# Altium schematic sheet Test Pins.SchDoc
size A; SheetNumber: 6; SheetTotal: 6
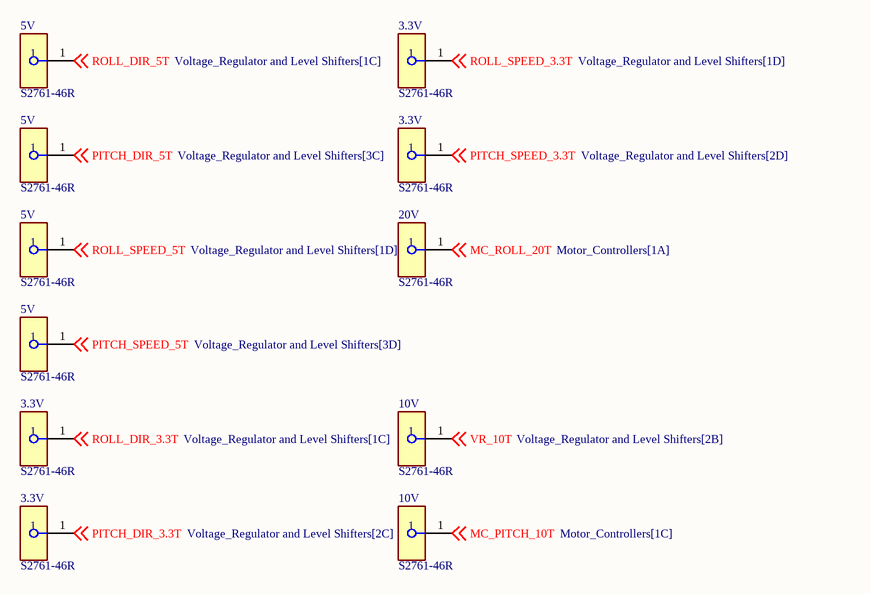
[diagram p0: Test Pins.SchDoc]

## Parts
(Parts that share a designator on the sheet are numbered #1, #2 ... from top to bottom, then left to right.)
3.3V#1  S2761-46R  [S2761-46R]
3.3V#2  S2761-46R  [S2761-46R]
3.3V#3  S2761-46R  [S2761-46R]
3.3V#4  S2761-46R  [S2761-46R]
5V#1  S2761-46R  [S2761-46R]
5V#2  S2761-46R  [S2761-46R]
5V#3  S2761-46R  [S2761-46R]
5V#4  S2761-46R  [S2761-46R]
10V#1  S2761-46R  [S2761-46R]
10V#2  S2761-46R  [S2761-46R]
20V  S2761-46R  [S2761-46R]

## Nets
MC_PITCH_10T: 10V#2.1 ; off-sheet MC_PITCH_10T
MC_ROLL_20T: 20V.1 ; off-sheet MC_ROLL_20T
PITCH_DIR_3.3T: 3.3V#4.1 ; off-sheet PITCH_DIR_3.3T
PITCH_DIR_5T: 5V#2.1 ; off-sheet PITCH_DIR_5T
PITCH_SPEED_3.3T: 3.3V#2.1 ; off-sheet PITCH_SPEED_3.3T
PITCH_SPEED_5T: 5V#4.1 ; off-sheet PITCH_SPEED_5T
ROLL_DIR_3.3T: 3.3V#3.1 ; off-sheet ROLL_DIR_3.3T
ROLL_DIR_5T: 5V#1.1 ; off-sheet ROLL_DIR_5T
ROLL_SPEED_3.3T: 3.3V#1.1 ; off-sheet ROLL_SPEED_3.3T
ROLL_SPEED_5T: 5V#3.1 ; off-sheet ROLL_SPEED_5T
VR_10T: 10V#1.1 ; off-sheet VR_10T

## Library data of the parts
3.3V#1-3.3V#4 5V#1-5V#4 10V#1 10V#2 20V = Test Point: PC TEST POINT NATURAL; Body Material: Brass; Plating: Tin; Material: Copper Alloy; Mount: Surface Mount; Color: Natural; Packaging: Tape and Reel; RoHS Compliant: Yes; MPN: S2761-46R; DNI: DNI; DNP: DNP